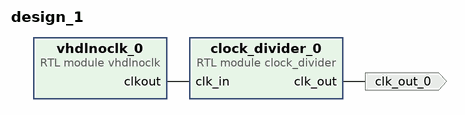
[diagram p0: block diagram of the top level]
# Vivado block design design_1, xc7z007sclg225-1, Vivado 2019.2
create_bd_design design_1

create_bd_port -dir O clk_out_0

create_bd_cell -type module -reference vhdlnoclk vhdlnoclk_0
create_bd_cell -type module -reference clock_divider clock_divider_0

# ---- connections ----

connect_bd_net [get_bd_pins clock_divider_0/clk_out] [get_bd_ports clk_out_0]
connect_bd_net [get_bd_pins vhdlnoclk_0/clkout] [get_bd_pins clock_divider_0/clk_in]

validate_bd_design
save_bd_design
